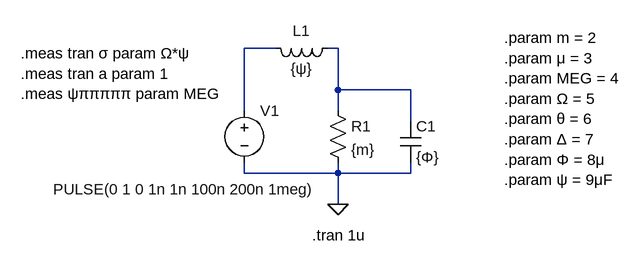
[diagram p0: schematic test15.asc]
test15.asc, the LTspice schematic file:
Version 4
SHEET 1 880 680
WIRE 144 48 96 48
WIRE 240 48 224 48
WIRE 240 112 240 48
WIRE 352 112 240 112
WIRE 96 144 96 48
WIRE 240 144 240 112
WIRE 352 160 352 112
WIRE 96 240 96 224
WIRE 240 240 240 224
WIRE 240 240 96 240
WIRE 352 240 352 224
WIRE 352 240 240 240
WIRE 240 288 240 240
FLAG 240 288 0
SYMBOL voltage 96 128 R0
WINDOW 3 -294 137 Left 2
WINDOW 123 0 0 Left 2
WINDOW 39 0 0 Left 2
SYMATTR InstName V1
SYMATTR Value PULSE(0 1 0 1n 1n 100n 200n 1meg)
SYMBOL res 224 128 R0
SYMATTR InstName R1
SYMATTR Value {m}
SYMBOL cap 336 160 R0
SYMATTR InstName C1
SYMATTR Value {Φ}
SYMBOL ind 240 32 R90
WINDOW 0 5 56 VBottom 2
WINDOW 3 32 56 VTop 2
SYMATTR InstName L1
SYMATTR Value {ψ}
TEXT 200 336 Left 2 !.tran 1u
TEXT 496 32 Left 2 !.param m = 2\n.param μ = 3\n.param MEG = 4\n.param Ω = 5\n.param θ = 6\n.param Δ = 7\n.param Φ = 8μ\n.param ψ = 9μF
TEXT -248 56 Left 2 !.meas tran σ param Ω*ψ\n.meas tran a param 1\n.meas ψπππππ param MEG

The netlist it stands for:
* test15.asc
V1 N001 0 PULSE(0 1 0 1n 1n 100n 200n 1meg)
R1 N002 0 {m}
C1 N002 0 {Φ}
L1 N002 N001 {ψ}
.tran 1u
.param m = 2
.param μ = 3
.param MEG = 4
.param Ω = 5
.param θ = 6
.param Δ = 7
.param Φ = 8μ
.param ψ = 9μF
.meas tran σ param Ω*ψ
.meas tran a param 1
.meas ψπππππ param MEG
.backanno
.end